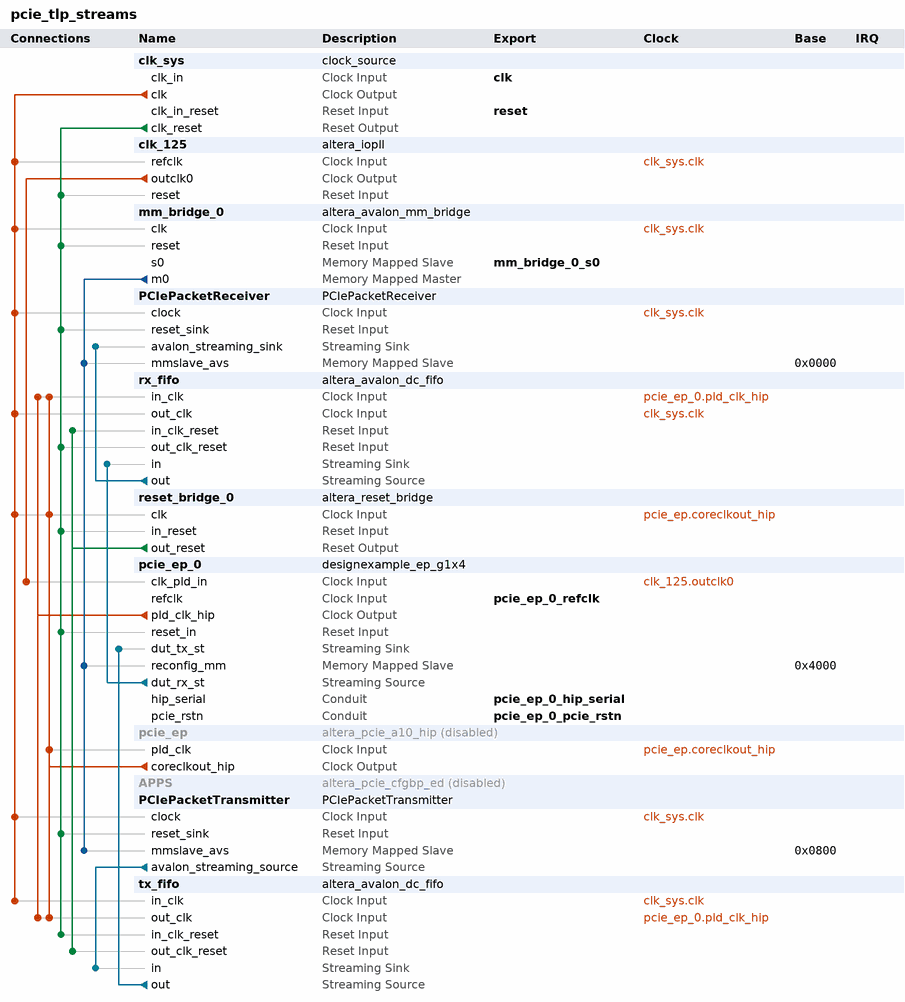
[diagram p0: system contents]
# Platform Designer (Qsys) system pcie_tlp_streams, Arria 10 10AS066N3F40E2SGE2
# Parameters at their usual value, and those the tool derives, are not listed.
package require -exact qsys 17.1
create_system pcie_tlp_streams
set_project_property DEVICE_FAMILY {Arria 10}
set_project_property DEVICE 10AS066N3F40E2SGE2

add_instance clk_sys clock_source 17.1
set_instance_parameter_value clk_sys clockFrequency 100000000

add_instance clk_125 altera_iopll 17.1
set_instance_parameter_value clk_125 gui_c_cnt_in_src0 c_m_cnt_in_src_ph_mux_clk
set_instance_parameter_value clk_125 gui_cal_code_hex_file iossm.hex
set_instance_parameter_value clk_125 gui_cal_converge false
set_instance_parameter_value clk_125 gui_cal_error cal_clean
set_instance_parameter_value clk_125 gui_clock_name_global false
set_instance_parameter_value clk_125 gui_clock_name_string0 clk125
set_instance_parameter_value clk_125 gui_clock_to_compensate 0
set_instance_parameter_value clk_125 gui_debug_mode false
set_instance_parameter_value clk_125 gui_en_lvds_ports Disabled
set_instance_parameter_value clk_125 gui_existing_mif_file_path {~/pll.mif}
set_instance_parameter_value clk_125 gui_include_iossm false
set_instance_parameter_value clk_125 gui_lock_setting {Low Lock Time}
set_instance_parameter_value clk_125 gui_mif_config_name unnamed
set_instance_parameter_value clk_125 gui_mif_gen_options {Generate New MIF File}
set_instance_parameter_value clk_125 gui_new_mif_file_path {~/pll.mif}
set_instance_parameter_value clk_125 gui_number_of_clocks 1
set_instance_parameter_value clk_125 gui_operation_mode direct
set_instance_parameter_value clk_125 gui_output_clock_frequency0 125.0
set_instance_parameter_value clk_125 gui_parameter_table_hex_file seq_params_sim.hex
set_instance_parameter_value clk_125 gui_pll_cal_done false
set_instance_parameter_value clk_125 gui_pll_freqcal_en true
set_instance_parameter_value clk_125 gui_pll_freqcal_req_flag true
set_instance_parameter_value clk_125 gui_pll_m_cnt_in_src c_m_cnt_in_src_ph_mux_clk
set_instance_parameter_value clk_125 gui_pll_tclk_mux_en false
set_instance_parameter_value clk_125 gui_pll_tclk_sel pll_tclk_m_src
set_instance_parameter_value clk_125 gui_pll_type S10_Simple
set_instance_parameter_value clk_125 gui_pll_vco_freq_band_0 pll_freq_clk0_disabled
set_instance_parameter_value clk_125 gui_reference_clock_frequency 100.0
set_instance_parameter_value clk_125 gui_use_NDFB_modes false
set_instance_parameter_value clk_125 gui_use_locked true
set_instance_parameter_value clk_125 gui_usr_device_speed_grade 1
set_instance_parameter_value clk_125 gui_vco_frequency 600.0
set_instance_parameter_value clk_125 hp_qsys_scripting_mode false
set_instance_parameter_value clk_125 system_info_device_component 10AS066N3F40E2SGE2
set_instance_parameter_value clk_125 system_info_device_speed_grade 2
set_instance_parameter_value clk_125 system_part_trait_speed_grade 2

add_instance mm_bridge_0 altera_avalon_mm_bridge 17.1
set_instance_parameter_value mm_bridge_0 ADDRESS_UNITS SYMBOLS
set_instance_parameter_value mm_bridge_0 ADDRESS_WIDTH 10
set_instance_parameter_value mm_bridge_0 DATA_WIDTH 64
set_instance_parameter_value mm_bridge_0 MAX_PENDING_RESPONSES 1
set_instance_parameter_value mm_bridge_0 USE_AUTO_ADDRESS_WIDTH 1

add_instance PCIePacketReceiver PCIePacketReceiver 1.0

add_instance rx_fifo altera_avalon_dc_fifo 17.1
set_instance_parameter_value rx_fifo BITS_PER_SYMBOL 64
set_instance_parameter_value rx_fifo FIFO_DEPTH 16
set_instance_parameter_value rx_fifo USE_PACKETS 1

add_instance reset_bridge_0 altera_reset_bridge 17.1
set_instance_parameter_value reset_bridge_0 ACTIVE_LOW_RESET 0
set_instance_parameter_value reset_bridge_0 SYNCHRONOUS_EDGES deassert

add_instance pcie_ep_0 designexample_ep_g1x4 1.0

add_instance pcie_ep altera_pcie_a10_hip 17.1
set_instance_property pcie_ep ENABLED false
set_instance_parameter_value pcie_ep adme_enable_hwtcl 0
set_instance_parameter_value pcie_ep advance_error_reporting_hwtcl 0
set_instance_parameter_value pcie_ep apps_type_hwtcl 0
set_instance_parameter_value pcie_ep ari_support_hwtcl 0
set_instance_parameter_value pcie_ep ast_trs_num_desc_hwtcl 16
set_instance_parameter_value pcie_ep ast_trs_rxdata_width_hwtcl 256
set_instance_parameter_value pcie_ep ast_trs_rxdesc_width_hwtcl 256
set_instance_parameter_value pcie_ep ast_trs_rxmty_width_hwtcl 32
set_instance_parameter_value pcie_ep ast_trs_txdata_width_hwtcl 256
set_instance_parameter_value pcie_ep ast_trs_txdesc_width_hwtcl 256
set_instance_parameter_value pcie_ep ast_trs_txmty_width_hwtcl 32
set_instance_parameter_value pcie_ep ast_trs_txstatus_width_hwtcl 256
set_instance_parameter_value pcie_ep avmm_addr_width_hwtcl 32
set_instance_parameter_value pcie_ep bar0_address_width_hwtcl 20
set_instance_parameter_value pcie_ep bar0_type_hwtcl {64-bit prefetchable memory}
set_instance_parameter_value pcie_ep bar1_address_width_hwtcl 0
set_instance_parameter_value pcie_ep bar1_type_hwtcl Disabled
set_instance_parameter_value pcie_ep bar2_address_width_hwtcl 0
set_instance_parameter_value pcie_ep bar2_type_hwtcl Disabled
set_instance_parameter_value pcie_ep bar3_address_width_hwtcl 0
set_instance_parameter_value pcie_ep bar3_type_hwtcl Disabled
set_instance_parameter_value pcie_ep base_device NIGHTFURY5
set_instance_parameter_value pcie_ep bfm_drive_interface_clk_hwtcl 1
set_instance_parameter_value pcie_ep bfm_drive_interface_control_hwtcl 1
set_instance_parameter_value pcie_ep bfm_drive_interface_npor_hwtcl 1
set_instance_parameter_value pcie_ep bfm_drive_interface_pipe_hwtcl 1
set_instance_parameter_value pcie_ep cg_a2p_addr_map_pass_thru_bits_hwtcl 20
set_instance_parameter_value pcie_ep cg_enable_a2p_interrupt_hwtcl 1
set_instance_parameter_value pcie_ep cg_enable_advanced_interrupt_hwtcl 0
set_instance_parameter_value pcie_ep class_code_hwtcl 0
set_instance_parameter_value pcie_ep completion_timeout_hwtcl NONE
set_instance_parameter_value pcie_ep cseb_autonomous_hwtcl 0
set_instance_parameter_value pcie_ep cseb_config_bypass_gui_hwtcl 0
set_instance_parameter_value pcie_ep design_environment_hwtcl QSYS
set_instance_parameter_value pcie_ep devhide_support_hwtcl 0
set_instance_parameter_value pcie_ep device_embedded_ep_support_hwtcl 0
set_instance_parameter_value pcie_ep device_id_hwtcl 57345
set_instance_parameter_value pcie_ep dis_adapt 0
set_instance_parameter_value pcie_ep dma_use_scfifo_ext_hwtcl 0
set_instance_parameter_value pcie_ep ecrc_check_capable_hwtcl 0
set_instance_parameter_value pcie_ep ecrc_gen_capable_hwtcl 0
set_instance_parameter_value pcie_ep enable_ast_trs_hwtcl 0
set_instance_parameter_value pcie_ep enable_avst_reset_hwtcl 0
set_instance_parameter_value pcie_ep enable_custom_features_hwtcl 0
set_instance_parameter_value pcie_ep enable_devkit_conduit_hwtcl 0
set_instance_parameter_value pcie_ep enable_example_design_qii_hwtcl 0
set_instance_parameter_value pcie_ep enable_example_design_sim_hwtcl 0
set_instance_parameter_value pcie_ep enable_example_design_synth_hwtcl 0
set_instance_parameter_value pcie_ep enable_example_design_tb_hwtcl 0
set_instance_parameter_value pcie_ep enable_gen3phase2eq_timechange 0
set_instance_parameter_value pcie_ep enable_hip_status_for_avmm_hwtcl 0
set_instance_parameter_value pcie_ep enable_lmi_hwtcl 1
set_instance_parameter_value pcie_ep enable_nobar_slection_hwtcl 0
set_instance_parameter_value pcie_ep enable_rxm_burst_hwtcl 0
set_instance_parameter_value pcie_ep enable_skp_det 0
set_instance_parameter_value pcie_ep enable_soft_dfe 0
set_instance_parameter_value pcie_ep export_fpll_output_to_top_level_hwtcl 0
set_instance_parameter_value pcie_ep export_phy_input_to_top_level_hwtcl 0
set_instance_parameter_value pcie_ep extended_tag_support_hwtcl 0
set_instance_parameter_value pcie_ep flr_capability_user_hwtcl 0
set_instance_parameter_value pcie_ep force_tag_checking_on_hwtcl 0
set_instance_parameter_value pcie_ep gen3_coeff_1_hwtcl 9
set_instance_parameter_value pcie_ep gen3_coeff_3_ber_meas_hwtcl 12ms
set_instance_parameter_value pcie_ep include_virtio_capabilities_hwtcl 0
set_instance_parameter_value pcie_ep interface_type_hwtcl Avalon-ST
set_instance_parameter_value pcie_ep internal_controller_hwtcl 0
set_instance_parameter_value pcie_ep link2csr_width_hwtcl 16
set_instance_parameter_value pcie_ep maximum_payload_size_hwtcl 128
set_instance_parameter_value pcie_ep part_trait_device 10AX115S1F45I1SG
set_instance_parameter_value pcie_ep pf0_ats_invalidate_queue_depth_hwtcl 0
set_instance_parameter_value pcie_ep pf0_bar0_prefetchable_hwtcl 1
set_instance_parameter_value pcie_ep pf0_bar0_present_hwtcl 1
set_instance_parameter_value pcie_ep pf0_bar0_size_hwtcl 12
set_instance_parameter_value pcie_ep pf0_bar0_type_hwtcl 1
set_instance_parameter_value pcie_ep pf0_bar1_prefetchable_hwtcl 1
set_instance_parameter_value pcie_ep pf0_bar1_present_hwtcl 0
set_instance_parameter_value pcie_ep pf0_bar1_size_hwtcl 12
set_instance_parameter_value pcie_ep pf0_bar2_prefetchable_hwtcl 1
set_instance_parameter_value pcie_ep pf0_bar2_present_hwtcl 0
set_instance_parameter_value pcie_ep pf0_bar2_size_hwtcl 12
set_instance_parameter_value pcie_ep pf0_bar2_type_hwtcl 1
set_instance_parameter_value pcie_ep pf0_bar3_prefetchable_hwtcl 1
set_instance_parameter_value pcie_ep pf0_bar3_present_hwtcl 0
set_instance_parameter_value pcie_ep pf0_bar3_size_hwtcl 12
set_instance_parameter_value pcie_ep pf0_bar4_prefetchable_hwtcl 1
set_instance_parameter_value pcie_ep pf0_bar4_present_hwtcl 0
set_instance_parameter_value pcie_ep pf0_bar4_size_hwtcl 12
set_instance_parameter_value pcie_ep pf0_bar4_type_hwtcl 1
set_instance_parameter_value pcie_ep pf0_bar5_prefetchable_hwtcl 1
set_instance_parameter_value pcie_ep pf0_bar5_present_hwtcl 0
set_instance_parameter_value pcie_ep pf0_bar5_size_hwtcl 12
set_instance_parameter_value pcie_ep pf0_exprom_bar_present_hwtcl 0
set_instance_parameter_value pcie_ep pf0_exprom_bar_size_hwtcl 12
set_instance_parameter_value pcie_ep pf0_extra_bar_present_hwtcl 0
set_instance_parameter_value pcie_ep pf0_extra_bar_size_hwtcl 12
set_instance_parameter_value pcie_ep pf0_interrupt_pin_hwtcl inta
set_instance_parameter_value pcie_ep pf0_intr_line_hwtcl 0
set_instance_parameter_value pcie_ep pf0_msi_multi_message_capable_hwtcl 4
set_instance_parameter_value pcie_ep pf0_msix_pba_bir_hwtcl 0
set_instance_parameter_value pcie_ep pf0_msix_pba_offset_hwtcl 0
set_instance_parameter_value pcie_ep pf0_msix_table_bir_hwtcl 0
set_instance_parameter_value pcie_ep pf0_msix_table_offset_hwtcl 0
set_instance_parameter_value pcie_ep pf0_msix_table_size_hwtcl 0
set_instance_parameter_value pcie_ep pf0_pci_prog_intfc_byte_hwtcl 0
set_instance_parameter_value pcie_ep pf0_subclass_code_hwtcl 0
set_instance_parameter_value pcie_ep pf0_tph_dev_specific_mode_support_hwtcl 0
set_instance_parameter_value pcie_ep pf0_tph_int_mode_support_hwtcl 0
set_instance_parameter_value pcie_ep pf0_tph_st_table_location_hwtcl 0
set_instance_parameter_value pcie_ep pf0_tph_st_table_size_hwtcl 63
set_instance_parameter_value pcie_ep pf0_vf_bar0_prefetchable_hwtcl 1
set_instance_parameter_value pcie_ep pf0_vf_bar0_present_hwtcl 0
set_instance_parameter_value pcie_ep pf0_vf_bar0_size_hwtcl 12
set_instance_parameter_value pcie_ep pf0_vf_bar0_type_hwtcl 1
set_instance_parameter_value pcie_ep pf0_vf_bar1_prefetchable_hwtcl 1
set_instance_parameter_value pcie_ep pf0_vf_bar1_present_hwtcl 0
set_instance_parameter_value pcie_ep pf0_vf_bar1_size_hwtcl 12
set_instance_parameter_value pcie_ep pf0_vf_bar2_prefetchable_hwtcl 1
set_instance_parameter_value pcie_ep pf0_vf_bar2_present_hwtcl 0
set_instance_parameter_value pcie_ep pf0_vf_bar2_size_hwtcl 12
set_instance_parameter_value pcie_ep pf0_vf_bar2_type_hwtcl 1
set_instance_parameter_value pcie_ep pf0_vf_bar3_prefetchable_hwtcl 1
set_instance_parameter_value pcie_ep pf0_vf_bar3_present_hwtcl 0
set_instance_parameter_value pcie_ep pf0_vf_bar3_size_hwtcl 12
set_instance_parameter_value pcie_ep pf0_vf_bar4_prefetchable_hwtcl 1
set_instance_parameter_value pcie_ep pf0_vf_bar4_present_hwtcl 0
set_instance_parameter_value pcie_ep pf0_vf_bar4_size_hwtcl 12
set_instance_parameter_value pcie_ep pf0_vf_bar4_type_hwtcl 1
set_instance_parameter_value pcie_ep pf0_vf_bar5_prefetchable_hwtcl 1
set_instance_parameter_value pcie_ep pf0_vf_bar5_present_hwtcl 0
set_instance_parameter_value pcie_ep pf0_vf_bar5_size_hwtcl 12
set_instance_parameter_value pcie_ep pf0_vf_count_user_hwtcl 0
set_instance_parameter_value pcie_ep pf0_vf_device_id_hwtcl 0
set_instance_parameter_value pcie_ep pf0_vf_msix_pba_bir_hwtcl 0
set_instance_parameter_value pcie_ep pf0_vf_msix_pba_offset_hwtcl 0
set_instance_parameter_value pcie_ep pf0_vf_msix_tbl_bir_hwtcl 0
set_instance_parameter_value pcie_ep pf0_vf_msix_tbl_offset_hwtcl 0
set_instance_parameter_value pcie_ep pf0_vf_msix_tbl_size_hwtcl 0
set_instance_parameter_value pcie_ep pf0_vf_tph_dev_specific_mode_support_hwtcl 0
set_instance_parameter_value pcie_ep pf0_vf_tph_int_mode_support_hwtcl 0
set_instance_parameter_value pcie_ep pf0_vf_tph_st_table_location_hwtcl 0
set_instance_parameter_value pcie_ep pf0_vf_tph_st_table_size_hwtcl 63
set_instance_parameter_value pcie_ep pf0_virtio_capability_present_hwtcl 0
set_instance_parameter_value pcie_ep pf0_virtio_cmn_config_bar_indicator_hwtcl 0
set_instance_parameter_value pcie_ep pf0_virtio_cmn_config_bar_offset_hwtcl 0
set_instance_parameter_value pcie_ep pf0_virtio_cmn_config_structure_length_hwtcl 0
set_instance_parameter_value pcie_ep pf0_virtio_device_specific_cap_present_hwtcl 0
set_instance_parameter_value pcie_ep pf0_virtio_devspecific_bar_indicator_hwtcl 0
set_instance_parameter_value pcie_ep pf0_virtio_devspecific_bar_offset_hwtcl 0
set_instance_parameter_value pcie_ep pf0_virtio_devspecific_structure_length_hwtcl 0
set_instance_parameter_value pcie_ep pf0_virtio_isrstatus_bar_indicator_hwtcl 0
set_instance_parameter_value pcie_ep pf0_virtio_isrstatus_bar_offset_hwtcl 0
set_instance_parameter_value pcie_ep pf0_virtio_isrstatus_structure_length_hwtcl 0
set_instance_parameter_value pcie_ep pf0_virtio_notification_bar_indicator_hwtcl 0
set_instance_parameter_value pcie_ep pf0_virtio_notification_bar_offset_hwtcl 0
set_instance_parameter_value pcie_ep pf0_virtio_notification_structure_length_hwtcl 0
set_instance_parameter_value pcie_ep pf0_virtio_pciconfig_access_bar_indicator_hwtcl 0
set_instance_parameter_value pcie_ep pf0_virtio_pciconfig_access_bar_offset_hwtcl 0
set_instance_parameter_value pcie_ep pf0_virtio_pciconfig_access_structure_length_hwtcl 0
set_instance_parameter_value pcie_ep pf1_ats_invalidate_queue_depth_hwtcl 0
set_instance_parameter_value pcie_ep pf1_bar0_prefetchable_hwtcl 1
set_instance_parameter_value pcie_ep pf1_bar0_present_hwtcl 0
set_instance_parameter_value pcie_ep pf1_bar0_size_hwtcl 12
set_instance_parameter_value pcie_ep pf1_bar0_type_hwtcl 1
set_instance_parameter_value pcie_ep pf1_bar1_prefetchable_hwtcl 1
set_instance_parameter_value pcie_ep pf1_bar1_present_hwtcl 0
set_instance_parameter_value pcie_ep pf1_bar1_size_hwtcl 12
set_instance_parameter_value pcie_ep pf1_bar2_prefetchable_hwtcl 1
set_instance_parameter_value pcie_ep pf1_bar2_present_hwtcl 0
set_instance_parameter_value pcie_ep pf1_bar2_size_hwtcl 12
set_instance_parameter_value pcie_ep pf1_bar2_type_hwtcl 1
set_instance_parameter_value pcie_ep pf1_bar3_prefetchable_hwtcl 1
set_instance_parameter_value pcie_ep pf1_bar3_present_hwtcl 0
set_instance_parameter_value pcie_ep pf1_bar3_size_hwtcl 12
set_instance_parameter_value pcie_ep pf1_bar4_prefetchable_hwtcl 1
set_instance_parameter_value pcie_ep pf1_bar4_present_hwtcl 0
set_instance_parameter_value pcie_ep pf1_bar4_size_hwtcl 12
set_instance_parameter_value pcie_ep pf1_bar4_type_hwtcl 1
set_instance_parameter_value pcie_ep pf1_bar5_prefetchable_hwtcl 1
set_instance_parameter_value pcie_ep pf1_bar5_present_hwtcl 0
set_instance_parameter_value pcie_ep pf1_bar5_size_hwtcl 12
set_instance_parameter_value pcie_ep pf1_class_code_hwtcl 0
set_instance_parameter_value pcie_ep pf1_device_id_hwtcl 0
set_instance_parameter_value pcie_ep pf1_exprom_bar_present_hwtcl 0
set_instance_parameter_value pcie_ep pf1_exprom_bar_size_hwtcl 12
set_instance_parameter_value pcie_ep pf1_interrupt_pin_hwtcl inta
set_instance_parameter_value pcie_ep pf1_intr_line_hwtcl 0
set_instance_parameter_value pcie_ep pf1_msi_multi_message_capable_hwtcl 4
set_instance_parameter_value pcie_ep pf1_msix_pba_bir_hwtcl 0
set_instance_parameter_value pcie_ep pf1_msix_pba_offset_hwtcl 0
set_instance_parameter_value pcie_ep pf1_msix_table_bir_hwtcl 0
set_instance_parameter_value pcie_ep pf1_msix_table_offset_hwtcl 0
set_instance_parameter_value pcie_ep pf1_msix_table_size_hwtcl 0
set_instance_parameter_value pcie_ep pf1_pci_prog_intfc_byte_hwtcl 0
set_instance_parameter_value pcie_ep pf1_revision_id_hwtcl 0
set_instance_parameter_value pcie_ep pf1_subclass_code_hwtcl 0
set_instance_parameter_value pcie_ep pf1_subsystem_device_id_hwtcl 0
set_instance_parameter_value pcie_ep pf1_subsystem_vendor_id_hwtcl 0
set_instance_parameter_value pcie_ep pf1_tph_dev_specific_mode_support_hwtcl 0
set_instance_parameter_value pcie_ep pf1_tph_int_mode_support_hwtcl 0
set_instance_parameter_value pcie_ep pf1_tph_st_table_location_hwtcl 0
set_instance_parameter_value pcie_ep pf1_tph_st_table_size_hwtcl 63
set_instance_parameter_value pcie_ep pf1_vendor_id_hwtcl 0
set_instance_parameter_value pcie_ep pf1_vf_bar0_prefetchable_hwtcl 1
set_instance_parameter_value pcie_ep pf1_vf_bar0_present_hwtcl 0
set_instance_parameter_value pcie_ep pf1_vf_bar0_size_hwtcl 12
set_instance_parameter_value pcie_ep pf1_vf_bar0_type_hwtcl 1
set_instance_parameter_value pcie_ep pf1_vf_bar1_prefetchable_hwtcl 1
set_instance_parameter_value pcie_ep pf1_vf_bar1_present_hwtcl 0
set_instance_parameter_value pcie_ep pf1_vf_bar1_size_hwtcl 12
set_instance_parameter_value pcie_ep pf1_vf_bar2_prefetchable_hwtcl 1
set_instance_parameter_value pcie_ep pf1_vf_bar2_present_hwtcl 0
set_instance_parameter_value pcie_ep pf1_vf_bar2_size_hwtcl 12
set_instance_parameter_value pcie_ep pf1_vf_bar2_type_hwtcl 1
set_instance_parameter_value pcie_ep pf1_vf_bar3_prefetchable_hwtcl 1
set_instance_parameter_value pcie_ep pf1_vf_bar3_present_hwtcl 0
set_instance_parameter_value pcie_ep pf1_vf_bar3_size_hwtcl 12
set_instance_parameter_value pcie_ep pf1_vf_bar4_prefetchable_hwtcl 1
set_instance_parameter_value pcie_ep pf1_vf_bar4_present_hwtcl 0
set_instance_parameter_value pcie_ep pf1_vf_bar4_size_hwtcl 12
set_instance_parameter_value pcie_ep pf1_vf_bar4_type_hwtcl 1
set_instance_parameter_value pcie_ep pf1_vf_bar5_prefetchable_hwtcl 1
set_instance_parameter_value pcie_ep pf1_vf_bar5_present_hwtcl 0
set_instance_parameter_value pcie_ep pf1_vf_bar5_size_hwtcl 12
set_instance_parameter_value pcie_ep pf1_vf_count_user_hwtcl 0
set_instance_parameter_value pcie_ep pf1_vf_device_id_hwtcl 0
set_instance_parameter_value pcie_ep pf1_vf_msix_pba_bir_hwtcl 0
set_instance_parameter_value pcie_ep pf1_vf_msix_pba_offset_hwtcl 0
set_instance_parameter_value pcie_ep pf1_vf_msix_tbl_bir_hwtcl 0
set_instance_parameter_value pcie_ep pf1_vf_msix_tbl_offset_hwtcl 0
set_instance_parameter_value pcie_ep pf1_vf_msix_tbl_size_hwtcl 0
set_instance_parameter_value pcie_ep pf1_vf_tph_dev_specific_mode_support_hwtcl 0
set_instance_parameter_value pcie_ep pf1_vf_tph_int_mode_support_hwtcl 0
set_instance_parameter_value pcie_ep pf1_vf_tph_st_table_location_hwtcl 0
set_instance_parameter_value pcie_ep pf1_vf_tph_st_table_size_hwtcl 63
set_instance_parameter_value pcie_ep pf1_virtio_capability_present_hwtcl 0
set_instance_parameter_value pcie_ep pf1_virtio_cmn_config_bar_indicator_hwtcl 0
set_instance_parameter_value pcie_ep pf1_virtio_cmn_config_bar_offset_hwtcl 0
set_instance_parameter_value pcie_ep pf1_virtio_cmn_config_structure_length_hwtcl 0
set_instance_parameter_value pcie_ep pf1_virtio_device_specific_cap_present_hwtcl 0
set_instance_parameter_value pcie_ep pf1_virtio_devspecific_bar_indicator_hwtcl 0
set_instance_parameter_value pcie_ep pf1_virtio_devspecific_bar_offset_hwtcl 0
set_instance_parameter_value pcie_ep pf1_virtio_devspecific_structure_length_hwtcl 0
set_instance_parameter_value pcie_ep pf1_virtio_isrstatus_bar_indicator_hwtcl 0
set_instance_parameter_value pcie_ep pf1_virtio_isrstatus_bar_offset_hwtcl 0
set_instance_parameter_value pcie_ep pf1_virtio_isrstatus_structure_length_hwtcl 0
set_instance_parameter_value pcie_ep pf1_virtio_notification_bar_indicator_hwtcl 0
set_instance_parameter_value pcie_ep pf1_virtio_notification_bar_offset_hwtcl 0
set_instance_parameter_value pcie_ep pf1_virtio_notification_structure_length_hwtcl 0
set_instance_parameter_value pcie_ep pf1_virtio_pciconfig_access_bar_indicator_hwtcl 0
set_instance_parameter_value pcie_ep pf1_virtio_pciconfig_access_bar_offset_hwtcl 0
set_instance_parameter_value pcie_ep pf1_virtio_pciconfig_access_structure_length_hwtcl 0
set_instance_parameter_value pcie_ep pf2_ats_invalidate_queue_depth_hwtcl 0
set_instance_parameter_value pcie_ep pf2_bar0_prefetchable_hwtcl 1
set_instance_parameter_value pcie_ep pf2_bar0_present_hwtcl 0
set_instance_parameter_value pcie_ep pf2_bar0_size_hwtcl 12
set_instance_parameter_value pcie_ep pf2_bar0_type_hwtcl 1
set_instance_parameter_value pcie_ep pf2_bar1_prefetchable_hwtcl 1
set_instance_parameter_value pcie_ep pf2_bar1_present_hwtcl 0
set_instance_parameter_value pcie_ep pf2_bar1_size_hwtcl 12
set_instance_parameter_value pcie_ep pf2_bar2_prefetchable_hwtcl 1
set_instance_parameter_value pcie_ep pf2_bar2_present_hwtcl 0
set_instance_parameter_value pcie_ep pf2_bar2_size_hwtcl 12
set_instance_parameter_value pcie_ep pf2_bar2_type_hwtcl 1
set_instance_parameter_value pcie_ep pf2_bar3_prefetchable_hwtcl 1
set_instance_parameter_value pcie_ep pf2_bar3_present_hwtcl 0
set_instance_parameter_value pcie_ep pf2_bar3_size_hwtcl 12
set_instance_parameter_value pcie_ep pf2_bar4_prefetchable_hwtcl 1
set_instance_parameter_value pcie_ep pf2_bar4_present_hwtcl 0
set_instance_parameter_value pcie_ep pf2_bar4_size_hwtcl 12
set_instance_parameter_value pcie_ep pf2_bar4_type_hwtcl 1
set_instance_parameter_value pcie_ep pf2_bar5_prefetchable_hwtcl 1
set_instance_parameter_value pcie_ep pf2_bar5_present_hwtcl 0
set_instance_parameter_value pcie_ep pf2_bar5_size_hwtcl 12
set_instance_parameter_value pcie_ep pf2_class_code_hwtcl 0
set_instance_parameter_value pcie_ep pf2_device_id_hwtcl 0
set_instance_parameter_value pcie_ep pf2_exprom_bar_present_hwtcl 0
set_instance_parameter_value pcie_ep pf2_exprom_bar_size_hwtcl 12
set_instance_parameter_value pcie_ep pf2_interrupt_pin_hwtcl inta
set_instance_parameter_value pcie_ep pf2_intr_line_hwtcl 0
set_instance_parameter_value pcie_ep pf2_msi_multi_message_capable_hwtcl 4
set_instance_parameter_value pcie_ep pf2_msix_pba_bir_hwtcl 0
set_instance_parameter_value pcie_ep pf2_msix_pba_offset_hwtcl 0
set_instance_parameter_value pcie_ep pf2_msix_table_bir_hwtcl 0
set_instance_parameter_value pcie_ep pf2_msix_table_offset_hwtcl 0
set_instance_parameter_value pcie_ep pf2_msix_table_size_hwtcl 0
set_instance_parameter_value pcie_ep pf2_pci_prog_intfc_byte_hwtcl 0
set_instance_parameter_value pcie_ep pf2_revision_id_hwtcl 0
set_instance_parameter_value pcie_ep pf2_subclass_code_hwtcl 0
set_instance_parameter_value pcie_ep pf2_subsystem_device_id_hwtcl 0
set_instance_parameter_value pcie_ep pf2_subsystem_vendor_id_hwtcl 0
set_instance_parameter_value pcie_ep pf2_tph_dev_specific_mode_support_hwtcl 0
set_instance_parameter_value pcie_ep pf2_tph_int_mode_support_hwtcl 0
set_instance_parameter_value pcie_ep pf2_tph_st_table_location_hwtcl 0
set_instance_parameter_value pcie_ep pf2_tph_st_table_size_hwtcl 63
set_instance_parameter_value pcie_ep pf2_vendor_id_hwtcl 0
set_instance_parameter_value pcie_ep pf2_vf_bar0_prefetchable_hwtcl 1
set_instance_parameter_value pcie_ep pf2_vf_bar0_present_hwtcl 0
set_instance_parameter_value pcie_ep pf2_vf_bar0_size_hwtcl 12
set_instance_parameter_value pcie_ep pf2_vf_bar0_type_hwtcl 1
set_instance_parameter_value pcie_ep pf2_vf_bar1_prefetchable_hwtcl 1
set_instance_parameter_value pcie_ep pf2_vf_bar1_present_hwtcl 0
set_instance_parameter_value pcie_ep pf2_vf_bar1_size_hwtcl 12
set_instance_parameter_value pcie_ep pf2_vf_bar2_prefetchable_hwtcl 1
set_instance_parameter_value pcie_ep pf2_vf_bar2_present_hwtcl 0
set_instance_parameter_value pcie_ep pf2_vf_bar2_size_hwtcl 12
set_instance_parameter_value pcie_ep pf2_vf_bar2_type_hwtcl 1
set_instance_parameter_value pcie_ep pf2_vf_bar3_prefetchable_hwtcl 1
set_instance_parameter_value pcie_ep pf2_vf_bar3_present_hwtcl 0
set_instance_parameter_value pcie_ep pf2_vf_bar3_size_hwtcl 12
set_instance_parameter_value pcie_ep pf2_vf_bar4_prefetchable_hwtcl 1
set_instance_parameter_value pcie_ep pf2_vf_bar4_present_hwtcl 0
set_instance_parameter_value pcie_ep pf2_vf_bar4_size_hwtcl 12
set_instance_parameter_value pcie_ep pf2_vf_bar4_type_hwtcl 1
set_instance_parameter_value pcie_ep pf2_vf_bar5_prefetchable_hwtcl 1
set_instance_parameter_value pcie_ep pf2_vf_bar5_present_hwtcl 0
set_instance_parameter_value pcie_ep pf2_vf_bar5_size_hwtcl 12
set_instance_parameter_value pcie_ep pf2_vf_count_user_hwtcl 0
set_instance_parameter_value pcie_ep pf2_vf_device_id_hwtcl 0
set_instance_parameter_value pcie_ep pf2_vf_msix_pba_bir_hwtcl 0
set_instance_parameter_value pcie_ep pf2_vf_msix_pba_offset_hwtcl 0
set_instance_parameter_value pcie_ep pf2_vf_msix_tbl_bir_hwtcl 0
set_instance_parameter_value pcie_ep pf2_vf_msix_tbl_offset_hwtcl 0
set_instance_parameter_value pcie_ep pf2_vf_msix_tbl_size_hwtcl 0
set_instance_parameter_value pcie_ep pf2_vf_tph_dev_specific_mode_support_hwtcl 0
set_instance_parameter_value pcie_ep pf2_vf_tph_int_mode_support_hwtcl 0
set_instance_parameter_value pcie_ep pf2_vf_tph_st_table_location_hwtcl 0
set_instance_parameter_value pcie_ep pf2_vf_tph_st_table_size_hwtcl 63
set_instance_parameter_value pcie_ep pf2_virtio_capability_present_hwtcl 0
set_instance_parameter_value pcie_ep pf2_virtio_cmn_config_bar_indicator_hwtcl 0
set_instance_parameter_value pcie_ep pf2_virtio_cmn_config_bar_offset_hwtcl 0
set_instance_parameter_value pcie_ep pf2_virtio_cmn_config_structure_length_hwtcl 0
set_instance_parameter_value pcie_ep pf2_virtio_device_specific_cap_present_hwtcl 0
set_instance_parameter_value pcie_ep pf2_virtio_devspecific_bar_indicator_hwtcl 0
set_instance_parameter_value pcie_ep pf2_virtio_devspecific_bar_offset_hwtcl 0
set_instance_parameter_value pcie_ep pf2_virtio_devspecific_structure_length_hwtcl 0
set_instance_parameter_value pcie_ep pf2_virtio_isrstatus_bar_indicator_hwtcl 0
set_instance_parameter_value pcie_ep pf2_virtio_isrstatus_bar_offset_hwtcl 0
set_instance_parameter_value pcie_ep pf2_virtio_isrstatus_structure_length_hwtcl 0
set_instance_parameter_value pcie_ep pf2_virtio_notification_bar_indicator_hwtcl 0
set_instance_parameter_value pcie_ep pf2_virtio_notification_bar_offset_hwtcl 0
set_instance_parameter_value pcie_ep pf2_virtio_notification_structure_length_hwtcl 0
set_instance_parameter_value pcie_ep pf2_virtio_pciconfig_access_bar_indicator_hwtcl 0
set_instance_parameter_value pcie_ep pf2_virtio_pciconfig_access_bar_offset_hwtcl 0
set_instance_parameter_value pcie_ep pf2_virtio_pciconfig_access_structure_length_hwtcl 0
set_instance_parameter_value pcie_ep pf3_ats_invalidate_queue_depth_hwtcl 0
set_instance_parameter_value pcie_ep pf3_bar0_prefetchable_hwtcl 1
set_instance_parameter_value pcie_ep pf3_bar0_present_hwtcl 0
set_instance_parameter_value pcie_ep pf3_bar0_size_hwtcl 12
set_instance_parameter_value pcie_ep pf3_bar0_type_hwtcl 1
set_instance_parameter_value pcie_ep pf3_bar1_prefetchable_hwtcl 1
set_instance_parameter_value pcie_ep pf3_bar1_present_hwtcl 0
set_instance_parameter_value pcie_ep pf3_bar1_size_hwtcl 12
set_instance_parameter_value pcie_ep pf3_bar2_prefetchable_hwtcl 1
set_instance_parameter_value pcie_ep pf3_bar2_present_hwtcl 0
set_instance_parameter_value pcie_ep pf3_bar2_size_hwtcl 12
set_instance_parameter_value pcie_ep pf3_bar2_type_hwtcl 1
set_instance_parameter_value pcie_ep pf3_bar3_prefetchable_hwtcl 1
set_instance_parameter_value pcie_ep pf3_bar3_present_hwtcl 0
set_instance_parameter_value pcie_ep pf3_bar3_size_hwtcl 12
set_instance_parameter_value pcie_ep pf3_bar4_prefetchable_hwtcl 1
set_instance_parameter_value pcie_ep pf3_bar4_present_hwtcl 0
set_instance_parameter_value pcie_ep pf3_bar4_size_hwtcl 12
set_instance_parameter_value pcie_ep pf3_bar4_type_hwtcl 1
set_instance_parameter_value pcie_ep pf3_bar5_prefetchable_hwtcl 1
set_instance_parameter_value pcie_ep pf3_bar5_present_hwtcl 0
set_instance_parameter_value pcie_ep pf3_bar5_size_hwtcl 12
set_instance_parameter_value pcie_ep pf3_class_code_hwtcl 0
set_instance_parameter_value pcie_ep pf3_device_id_hwtcl 0
set_instance_parameter_value pcie_ep pf3_exprom_bar_present_hwtcl 0
set_instance_parameter_value pcie_ep pf3_exprom_bar_size_hwtcl 12
set_instance_parameter_value pcie_ep pf3_interrupt_pin_hwtcl inta
set_instance_parameter_value pcie_ep pf3_intr_line_hwtcl 0
set_instance_parameter_value pcie_ep pf3_msi_multi_message_capable_hwtcl 4
set_instance_parameter_value pcie_ep pf3_msix_pba_bir_hwtcl 0
set_instance_parameter_value pcie_ep pf3_msix_pba_offset_hwtcl 0
set_instance_parameter_value pcie_ep pf3_msix_table_bir_hwtcl 0
set_instance_parameter_value pcie_ep pf3_msix_table_offset_hwtcl 0
set_instance_parameter_value pcie_ep pf3_msix_table_size_hwtcl 0
set_instance_parameter_value pcie_ep pf3_pci_prog_intfc_byte_hwtcl 0
set_instance_parameter_value pcie_ep pf3_revision_id_hwtcl 0
set_instance_parameter_value pcie_ep pf3_subclass_code_hwtcl 0
set_instance_parameter_value pcie_ep pf3_subsystem_device_id_hwtcl 0
set_instance_parameter_value pcie_ep pf3_subsystem_vendor_id_hwtcl 0
set_instance_parameter_value pcie_ep pf3_tph_dev_specific_mode_support_hwtcl 0
set_instance_parameter_value pcie_ep pf3_tph_int_mode_support_hwtcl 0
set_instance_parameter_value pcie_ep pf3_tph_st_table_location_hwtcl 0
set_instance_parameter_value pcie_ep pf3_tph_st_table_size_hwtcl 63
set_instance_parameter_value pcie_ep pf3_vendor_id_hwtcl 0
set_instance_parameter_value pcie_ep pf3_vf_bar0_prefetchable_hwtcl 1
set_instance_parameter_value pcie_ep pf3_vf_bar0_present_hwtcl 0
set_instance_parameter_value pcie_ep pf3_vf_bar0_size_hwtcl 12
set_instance_parameter_value pcie_ep pf3_vf_bar0_type_hwtcl 1
set_instance_parameter_value pcie_ep pf3_vf_bar1_prefetchable_hwtcl 1
set_instance_parameter_value pcie_ep pf3_vf_bar1_present_hwtcl 0
set_instance_parameter_value pcie_ep pf3_vf_bar1_size_hwtcl 12
set_instance_parameter_value pcie_ep pf3_vf_bar2_prefetchable_hwtcl 1
set_instance_parameter_value pcie_ep pf3_vf_bar2_present_hwtcl 0
set_instance_parameter_value pcie_ep pf3_vf_bar2_size_hwtcl 12
set_instance_parameter_value pcie_ep pf3_vf_bar2_type_hwtcl 1
set_instance_parameter_value pcie_ep pf3_vf_bar3_prefetchable_hwtcl 1
set_instance_parameter_value pcie_ep pf3_vf_bar3_present_hwtcl 0
set_instance_parameter_value pcie_ep pf3_vf_bar3_size_hwtcl 12
set_instance_parameter_value pcie_ep pf3_vf_bar4_prefetchable_hwtcl 1
set_instance_parameter_value pcie_ep pf3_vf_bar4_present_hwtcl 0
set_instance_parameter_value pcie_ep pf3_vf_bar4_size_hwtcl 12
set_instance_parameter_value pcie_ep pf3_vf_bar4_type_hwtcl 1
set_instance_parameter_value pcie_ep pf3_vf_bar5_prefetchable_hwtcl 1
set_instance_parameter_value pcie_ep pf3_vf_bar5_present_hwtcl 0
set_instance_parameter_value pcie_ep pf3_vf_bar5_size_hwtcl 12
set_instance_parameter_value pcie_ep pf3_vf_count_user_hwtcl 0
set_instance_parameter_value pcie_ep pf3_vf_device_id_hwtcl 0
set_instance_parameter_value pcie_ep pf3_vf_msix_pba_bir_hwtcl 0
set_instance_parameter_value pcie_ep pf3_vf_msix_pba_offset_hwtcl 0
set_instance_parameter_value pcie_ep pf3_vf_msix_tbl_bir_hwtcl 0
set_instance_parameter_value pcie_ep pf3_vf_msix_tbl_offset_hwtcl 0
set_instance_parameter_value pcie_ep pf3_vf_msix_tbl_size_hwtcl 0
set_instance_parameter_value pcie_ep pf3_vf_tph_dev_specific_mode_support_hwtcl 0
set_instance_parameter_value pcie_ep pf3_vf_tph_int_mode_support_hwtcl 0
set_instance_parameter_value pcie_ep pf3_vf_tph_st_table_location_hwtcl 0
set_instance_parameter_value pcie_ep pf3_vf_tph_st_table_size_hwtcl 63
set_instance_parameter_value pcie_ep pf3_virtio_capability_present_hwtcl 0
set_instance_parameter_value pcie_ep pf3_virtio_cmn_config_bar_indicator_hwtcl 0
set_instance_parameter_value pcie_ep pf3_virtio_cmn_config_bar_offset_hwtcl 0
set_instance_parameter_value pcie_ep pf3_virtio_cmn_config_structure_length_hwtcl 0
set_instance_parameter_value pcie_ep pf3_virtio_device_specific_cap_present_hwtcl 0
set_instance_parameter_value pcie_ep pf3_virtio_devspecific_bar_indicator_hwtcl 0
set_instance_parameter_value pcie_ep pf3_virtio_devspecific_bar_offset_hwtcl 0
set_instance_parameter_value pcie_ep pf3_virtio_devspecific_structure_length_hwtcl 0
set_instance_parameter_value pcie_ep pf3_virtio_isrstatus_bar_indicator_hwtcl 0
set_instance_parameter_value pcie_ep pf3_virtio_isrstatus_bar_offset_hwtcl 0
set_instance_parameter_value pcie_ep pf3_virtio_isrstatus_structure_length_hwtcl 0
set_instance_parameter_value pcie_ep pf3_virtio_notification_bar_indicator_hwtcl 0
set_instance_parameter_value pcie_ep pf3_virtio_notification_bar_offset_hwtcl 0
set_instance_parameter_value pcie_ep pf3_virtio_notification_structure_length_hwtcl 0
set_instance_parameter_value pcie_ep pf3_virtio_pciconfig_access_bar_indicator_hwtcl 0
set_instance_parameter_value pcie_ep pf3_virtio_pciconfig_access_bar_offset_hwtcl 0
set_instance_parameter_value pcie_ep pf3_virtio_pciconfig_access_structure_length_hwtcl 0
set_instance_parameter_value pcie_ep pf4_bar0_prefetchable_hwtcl 1
set_instance_parameter_value pcie_ep pf4_bar0_present_hwtcl 0
set_instance_parameter_value pcie_ep pf4_bar0_size_hwtcl 12
set_instance_parameter_value pcie_ep pf4_bar0_type_hwtcl 1
set_instance_parameter_value pcie_ep pf4_bar1_prefetchable_hwtcl 1
set_instance_parameter_value pcie_ep pf4_bar1_present_hwtcl 0
set_instance_parameter_value pcie_ep pf4_bar1_size_hwtcl 12
set_instance_parameter_value pcie_ep pf4_bar2_prefetchable_hwtcl 1
set_instance_parameter_value pcie_ep pf4_bar2_present_hwtcl 0
set_instance_parameter_value pcie_ep pf4_bar2_size_hwtcl 12
set_instance_parameter_value pcie_ep pf4_bar2_type_hwtcl 1
set_instance_parameter_value pcie_ep pf4_bar3_prefetchable_hwtcl 1
set_instance_parameter_value pcie_ep pf4_bar3_present_hwtcl 0
set_instance_parameter_value pcie_ep pf4_bar3_size_hwtcl 12
set_instance_parameter_value pcie_ep pf4_bar4_prefetchable_hwtcl 1
set_instance_parameter_value pcie_ep pf4_bar4_present_hwtcl 0
set_instance_parameter_value pcie_ep pf4_bar4_size_hwtcl 12
set_instance_parameter_value pcie_ep pf4_bar4_type_hwtcl 1
set_instance_parameter_value pcie_ep pf4_bar5_prefetchable_hwtcl 1
set_instance_parameter_value pcie_ep pf4_bar5_present_hwtcl 0
set_instance_parameter_value pcie_ep pf4_bar5_size_hwtcl 12
set_instance_parameter_value pcie_ep pf4_class_code_hwtcl 0
set_instance_parameter_value pcie_ep pf4_device_id_hwtcl 0
set_instance_parameter_value pcie_ep pf4_exprom_bar_present_hwtcl 0
set_instance_parameter_value pcie_ep pf4_exprom_bar_size_hwtcl 12
set_instance_parameter_value pcie_ep pf4_interrupt_pin_hwtcl inta
set_instance_parameter_value pcie_ep pf4_intr_line_hwtcl 0
set_instance_parameter_value pcie_ep pf4_msi_multi_message_capable_hwtcl 4
set_instance_parameter_value pcie_ep pf4_msix_pba_bir_hwtcl 0
set_instance_parameter_value pcie_ep pf4_msix_pba_offset_hwtcl 0
set_instance_parameter_value pcie_ep pf4_msix_table_bir_hwtcl 0
set_instance_parameter_value pcie_ep pf4_msix_table_offset_hwtcl 0
set_instance_parameter_value pcie_ep pf4_msix_table_size_hwtcl 0
set_instance_parameter_value pcie_ep pf4_pci_prog_intfc_byte_hwtcl 0
set_instance_parameter_value pcie_ep pf4_revision_id_hwtcl 0
set_instance_parameter_value pcie_ep pf4_subclass_code_hwtcl 0
set_instance_parameter_value pcie_ep pf4_subsystem_device_id_hwtcl 0
set_instance_parameter_value pcie_ep pf4_subsystem_vendor_id_hwtcl 0
set_instance_parameter_value pcie_ep pf4_vendor_id_hwtcl 0
set_instance_parameter_value pcie_ep pf4_vf_device_id_hwtcl 0
set_instance_parameter_value pcie_ep pf4_virtio_capability_present_hwtcl 0
set_instance_parameter_value pcie_ep pf4_virtio_cmn_config_bar_indicator_hwtcl 0
set_instance_parameter_value pcie_ep pf4_virtio_cmn_config_bar_offset_hwtcl 0
set_instance_parameter_value pcie_ep pf4_virtio_cmn_config_structure_length_hwtcl 0
set_instance_parameter_value pcie_ep pf4_virtio_device_specific_cap_present_hwtcl 0
set_instance_parameter_value pcie_ep pf4_virtio_devspecific_bar_indicator_hwtcl 0
set_instance_parameter_value pcie_ep pf4_virtio_devspecific_bar_offset_hwtcl 0
set_instance_parameter_value pcie_ep pf4_virtio_devspecific_structure_length_hwtcl 0
set_instance_parameter_value pcie_ep pf4_virtio_isrstatus_bar_indicator_hwtcl 0
set_instance_parameter_value pcie_ep pf4_virtio_isrstatus_bar_offset_hwtcl 0
set_instance_parameter_value pcie_ep pf4_virtio_isrstatus_structure_length_hwtcl 0
set_instance_parameter_value pcie_ep pf4_virtio_notification_bar_indicator_hwtcl 0
set_instance_parameter_value pcie_ep pf4_virtio_notification_bar_offset_hwtcl 0
set_instance_parameter_value pcie_ep pf4_virtio_notification_structure_length_hwtcl 0
set_instance_parameter_value pcie_ep pf4_virtio_pciconfig_access_bar_indicator_hwtcl 0
set_instance_parameter_value pcie_ep pf4_virtio_pciconfig_access_bar_offset_hwtcl 0
set_instance_parameter_value pcie_ep pf4_virtio_pciconfig_access_structure_length_hwtcl 0
set_instance_parameter_value pcie_ep pf5_bar0_prefetchable_hwtcl 1
set_instance_parameter_value pcie_ep pf5_bar0_present_hwtcl 0
set_instance_parameter_value pcie_ep pf5_bar0_size_hwtcl 12
set_instance_parameter_value pcie_ep pf5_bar0_type_hwtcl 1
set_instance_parameter_value pcie_ep pf5_bar1_prefetchable_hwtcl 1
set_instance_parameter_value pcie_ep pf5_bar1_present_hwtcl 0
set_instance_parameter_value pcie_ep pf5_bar1_size_hwtcl 12
set_instance_parameter_value pcie_ep pf5_bar2_prefetchable_hwtcl 1
set_instance_parameter_value pcie_ep pf5_bar2_present_hwtcl 0
set_instance_parameter_value pcie_ep pf5_bar2_size_hwtcl 12
set_instance_parameter_value pcie_ep pf5_bar2_type_hwtcl 1
set_instance_parameter_value pcie_ep pf5_bar3_prefetchable_hwtcl 1
set_instance_parameter_value pcie_ep pf5_bar3_present_hwtcl 0
set_instance_parameter_value pcie_ep pf5_bar3_size_hwtcl 12
set_instance_parameter_value pcie_ep pf5_bar4_prefetchable_hwtcl 1
set_instance_parameter_value pcie_ep pf5_bar4_present_hwtcl 0
set_instance_parameter_value pcie_ep pf5_bar4_size_hwtcl 12
set_instance_parameter_value pcie_ep pf5_bar4_type_hwtcl 1
set_instance_parameter_value pcie_ep pf5_bar5_prefetchable_hwtcl 1
set_instance_parameter_value pcie_ep pf5_bar5_present_hwtcl 0
set_instance_parameter_value pcie_ep pf5_bar5_size_hwtcl 12
set_instance_parameter_value pcie_ep pf5_class_code_hwtcl 0
set_instance_parameter_value pcie_ep pf5_device_id_hwtcl 0
set_instance_parameter_value pcie_ep pf5_exprom_bar_present_hwtcl 0
set_instance_parameter_value pcie_ep pf5_exprom_bar_size_hwtcl 12
set_instance_parameter_value pcie_ep pf5_interrupt_pin_hwtcl inta
set_instance_parameter_value pcie_ep pf5_intr_line_hwtcl 0
set_instance_parameter_value pcie_ep pf5_msi_multi_message_capable_hwtcl 4
set_instance_parameter_value pcie_ep pf5_msix_pba_bir_hwtcl 0
set_instance_parameter_value pcie_ep pf5_msix_pba_offset_hwtcl 0
set_instance_parameter_value pcie_ep pf5_msix_table_bir_hwtcl 0
set_instance_parameter_value pcie_ep pf5_msix_table_offset_hwtcl 0
set_instance_parameter_value pcie_ep pf5_msix_table_size_hwtcl 0
set_instance_parameter_value pcie_ep pf5_pci_prog_intfc_byte_hwtcl 0
set_instance_parameter_value pcie_ep pf5_revision_id_hwtcl 0
set_instance_parameter_value pcie_ep pf5_subclass_code_hwtcl 0
set_instance_parameter_value pcie_ep pf5_subsystem_device_id_hwtcl 0
set_instance_parameter_value pcie_ep pf5_subsystem_vendor_id_hwtcl 0
set_instance_parameter_value pcie_ep pf5_vendor_id_hwtcl 0
set_instance_parameter_value pcie_ep pf5_vf_device_id_hwtcl 0
set_instance_parameter_value pcie_ep pf5_virtio_capability_present_hwtcl 0
set_instance_parameter_value pcie_ep pf5_virtio_cmn_config_bar_indicator_hwtcl 0
set_instance_parameter_value pcie_ep pf5_virtio_cmn_config_bar_offset_hwtcl 0
set_instance_parameter_value pcie_ep pf5_virtio_cmn_config_structure_length_hwtcl 0
set_instance_parameter_value pcie_ep pf5_virtio_device_specific_cap_present_hwtcl 0
set_instance_parameter_value pcie_ep pf5_virtio_devspecific_bar_indicator_hwtcl 0
set_instance_parameter_value pcie_ep pf5_virtio_devspecific_bar_offset_hwtcl 0
set_instance_parameter_value pcie_ep pf5_virtio_devspecific_structure_length_hwtcl 0
set_instance_parameter_value pcie_ep pf5_virtio_isrstatus_bar_indicator_hwtcl 0
set_instance_parameter_value pcie_ep pf5_virtio_isrstatus_bar_offset_hwtcl 0
set_instance_parameter_value pcie_ep pf5_virtio_isrstatus_structure_length_hwtcl 0
set_instance_parameter_value pcie_ep pf5_virtio_notification_bar_indicator_hwtcl 0
set_instance_parameter_value pcie_ep pf5_virtio_notification_bar_offset_hwtcl 0
set_instance_parameter_value pcie_ep pf5_virtio_notification_structure_length_hwtcl 0
set_instance_parameter_value pcie_ep pf5_virtio_pciconfig_access_bar_indicator_hwtcl 0
set_instance_parameter_value pcie_ep pf5_virtio_pciconfig_access_bar_offset_hwtcl 0
set_instance_parameter_value pcie_ep pf5_virtio_pciconfig_access_structure_length_hwtcl 0
set_instance_parameter_value pcie_ep pf6_bar0_prefetchable_hwtcl 1
set_instance_parameter_value pcie_ep pf6_bar0_present_hwtcl 0
set_instance_parameter_value pcie_ep pf6_bar0_size_hwtcl 12
set_instance_parameter_value pcie_ep pf6_bar0_type_hwtcl 1
set_instance_parameter_value pcie_ep pf6_bar1_prefetchable_hwtcl 1
set_instance_parameter_value pcie_ep pf6_bar1_present_hwtcl 0
set_instance_parameter_value pcie_ep pf6_bar1_size_hwtcl 12
set_instance_parameter_value pcie_ep pf6_bar2_prefetchable_hwtcl 1
set_instance_parameter_value pcie_ep pf6_bar2_present_hwtcl 0
set_instance_parameter_value pcie_ep pf6_bar2_size_hwtcl 12
set_instance_parameter_value pcie_ep pf6_bar2_type_hwtcl 1
set_instance_parameter_value pcie_ep pf6_bar3_prefetchable_hwtcl 1
set_instance_parameter_value pcie_ep pf6_bar3_present_hwtcl 0
set_instance_parameter_value pcie_ep pf6_bar3_size_hwtcl 12
set_instance_parameter_value pcie_ep pf6_bar4_prefetchable_hwtcl 1
set_instance_parameter_value pcie_ep pf6_bar4_present_hwtcl 0
set_instance_parameter_value pcie_ep pf6_bar4_size_hwtcl 12
set_instance_parameter_value pcie_ep pf6_bar4_type_hwtcl 1
set_instance_parameter_value pcie_ep pf6_bar5_prefetchable_hwtcl 1
set_instance_parameter_value pcie_ep pf6_bar5_present_hwtcl 0
set_instance_parameter_value pcie_ep pf6_bar5_size_hwtcl 12
set_instance_parameter_value pcie_ep pf6_class_code_hwtcl 0
set_instance_parameter_value pcie_ep pf6_device_id_hwtcl 0
set_instance_parameter_value pcie_ep pf6_exprom_bar_present_hwtcl 0
set_instance_parameter_value pcie_ep pf6_exprom_bar_size_hwtcl 12
set_instance_parameter_value pcie_ep pf6_interrupt_pin_hwtcl inta
set_instance_parameter_value pcie_ep pf6_intr_line_hwtcl 0
set_instance_parameter_value pcie_ep pf6_msi_multi_message_capable_hwtcl 4
set_instance_parameter_value pcie_ep pf6_msix_pba_bir_hwtcl 0
set_instance_parameter_value pcie_ep pf6_msix_pba_offset_hwtcl 0
set_instance_parameter_value pcie_ep pf6_msix_table_bir_hwtcl 0
set_instance_parameter_value pcie_ep pf6_msix_table_offset_hwtcl 0
set_instance_parameter_value pcie_ep pf6_msix_table_size_hwtcl 0
set_instance_parameter_value pcie_ep pf6_pci_prog_intfc_byte_hwtcl 0
set_instance_parameter_value pcie_ep pf6_revision_id_hwtcl 0
set_instance_parameter_value pcie_ep pf6_subclass_code_hwtcl 0
set_instance_parameter_value pcie_ep pf6_subsystem_device_id_hwtcl 0
set_instance_parameter_value pcie_ep pf6_subsystem_vendor_id_hwtcl 0
set_instance_parameter_value pcie_ep pf6_vendor_id_hwtcl 0
set_instance_parameter_value pcie_ep pf6_vf_device_id_hwtcl 0
set_instance_parameter_value pcie_ep pf6_virtio_capability_present_hwtcl 0
set_instance_parameter_value pcie_ep pf6_virtio_cmn_config_bar_indicator_hwtcl 0
set_instance_parameter_value pcie_ep pf6_virtio_cmn_config_bar_offset_hwtcl 0
set_instance_parameter_value pcie_ep pf6_virtio_cmn_config_structure_length_hwtcl 0
set_instance_parameter_value pcie_ep pf6_virtio_device_specific_cap_present_hwtcl 0
set_instance_parameter_value pcie_ep pf6_virtio_devspecific_bar_indicator_hwtcl 0
set_instance_parameter_value pcie_ep pf6_virtio_devspecific_bar_offset_hwtcl 0
set_instance_parameter_value pcie_ep pf6_virtio_devspecific_structure_length_hwtcl 0
set_instance_parameter_value pcie_ep pf6_virtio_isrstatus_bar_indicator_hwtcl 0
set_instance_parameter_value pcie_ep pf6_virtio_isrstatus_bar_offset_hwtcl 0
set_instance_parameter_value pcie_ep pf6_virtio_isrstatus_structure_length_hwtcl 0
set_instance_parameter_value pcie_ep pf6_virtio_notification_bar_indicator_hwtcl 0
set_instance_parameter_value pcie_ep pf6_virtio_notification_bar_offset_hwtcl 0
set_instance_parameter_value pcie_ep pf6_virtio_notification_structure_length_hwtcl 0
set_instance_parameter_value pcie_ep pf6_virtio_pciconfig_access_bar_indicator_hwtcl 0
set_instance_parameter_value pcie_ep pf6_virtio_pciconfig_access_bar_offset_hwtcl 0
set_instance_parameter_value pcie_ep pf6_virtio_pciconfig_access_structure_length_hwtcl 0
set_instance_parameter_value pcie_ep pf7_bar0_prefetchable_hwtcl 1
set_instance_parameter_value pcie_ep pf7_bar0_present_hwtcl 0
set_instance_parameter_value pcie_ep pf7_bar0_size_hwtcl 12
set_instance_parameter_value pcie_ep pf7_bar0_type_hwtcl 1
set_instance_parameter_value pcie_ep pf7_bar1_prefetchable_hwtcl 1
set_instance_parameter_value pcie_ep pf7_bar1_present_hwtcl 0
set_instance_parameter_value pcie_ep pf7_bar1_size_hwtcl 12
set_instance_parameter_value pcie_ep pf7_bar2_prefetchable_hwtcl 1
set_instance_parameter_value pcie_ep pf7_bar2_present_hwtcl 0
set_instance_parameter_value pcie_ep pf7_bar2_size_hwtcl 12
set_instance_parameter_value pcie_ep pf7_bar2_type_hwtcl 1
set_instance_parameter_value pcie_ep pf7_bar3_prefetchable_hwtcl 1
set_instance_parameter_value pcie_ep pf7_bar3_present_hwtcl 0
set_instance_parameter_value pcie_ep pf7_bar3_size_hwtcl 12
set_instance_parameter_value pcie_ep pf7_bar4_prefetchable_hwtcl 1
set_instance_parameter_value pcie_ep pf7_bar4_present_hwtcl 0
set_instance_parameter_value pcie_ep pf7_bar4_size_hwtcl 12
set_instance_parameter_value pcie_ep pf7_bar4_type_hwtcl 1
set_instance_parameter_value pcie_ep pf7_bar5_prefetchable_hwtcl 1
set_instance_parameter_value pcie_ep pf7_bar5_present_hwtcl 0
set_instance_parameter_value pcie_ep pf7_bar5_size_hwtcl 12
set_instance_parameter_value pcie_ep pf7_class_code_hwtcl 0
set_instance_parameter_value pcie_ep pf7_device_id_hwtcl 0
set_instance_parameter_value pcie_ep pf7_exprom_bar_present_hwtcl 0
set_instance_parameter_value pcie_ep pf7_exprom_bar_size_hwtcl 12
set_instance_parameter_value pcie_ep pf7_interrupt_pin_hwtcl inta
set_instance_parameter_value pcie_ep pf7_intr_line_hwtcl 0
set_instance_parameter_value pcie_ep pf7_msi_multi_message_capable_hwtcl 4
set_instance_parameter_value pcie_ep pf7_msix_pba_bir_hwtcl 0
set_instance_parameter_value pcie_ep pf7_msix_pba_offset_hwtcl 0
set_instance_parameter_value pcie_ep pf7_msix_table_bir_hwtcl 0
set_instance_parameter_value pcie_ep pf7_msix_table_offset_hwtcl 0
set_instance_parameter_value pcie_ep pf7_msix_table_size_hwtcl 0
set_instance_parameter_value pcie_ep pf7_pci_prog_intfc_byte_hwtcl 0
set_instance_parameter_value pcie_ep pf7_revision_id_hwtcl 0
set_instance_parameter_value pcie_ep pf7_subclass_code_hwtcl 0
set_instance_parameter_value pcie_ep pf7_subsystem_device_id_hwtcl 0
set_instance_parameter_value pcie_ep pf7_subsystem_vendor_id_hwtcl 0
set_instance_parameter_value pcie_ep pf7_vendor_id_hwtcl 0
set_instance_parameter_value pcie_ep pf7_vf_device_id_hwtcl 0
set_instance_parameter_value pcie_ep pf7_virtio_capability_present_hwtcl 0
set_instance_parameter_value pcie_ep pf7_virtio_cmn_config_bar_indicator_hwtcl 0
set_instance_parameter_value pcie_ep pf7_virtio_cmn_config_bar_offset_hwtcl 0
set_instance_parameter_value pcie_ep pf7_virtio_cmn_config_structure_length_hwtcl 0
set_instance_parameter_value pcie_ep pf7_virtio_device_specific_cap_present_hwtcl 0
set_instance_parameter_value pcie_ep pf7_virtio_devspecific_bar_indicator_hwtcl 0
set_instance_parameter_value pcie_ep pf7_virtio_devspecific_bar_offset_hwtcl 0
set_instance_parameter_value pcie_ep pf7_virtio_devspecific_structure_length_hwtcl 0
set_instance_parameter_value pcie_ep pf7_virtio_isrstatus_bar_indicator_hwtcl 0
set_instance_parameter_value pcie_ep pf7_virtio_isrstatus_bar_offset_hwtcl 0
set_instance_parameter_value pcie_ep pf7_virtio_isrstatus_structure_length_hwtcl 0
set_instance_parameter_value pcie_ep pf7_virtio_notification_bar_indicator_hwtcl 0
set_instance_parameter_value pcie_ep pf7_virtio_notification_bar_offset_hwtcl 0
set_instance_parameter_value pcie_ep pf7_virtio_notification_structure_length_hwtcl 0
set_instance_parameter_value pcie_ep pf7_virtio_pciconfig_access_bar_indicator_hwtcl 0
set_instance_parameter_value pcie_ep pf7_virtio_pciconfig_access_bar_offset_hwtcl 0
set_instance_parameter_value pcie_ep pf7_virtio_pciconfig_access_structure_length_hwtcl 0
set_instance_parameter_value pcie_ep pf_ats_support_hwtcl 0
set_instance_parameter_value pcie_ep pf_enable_function_msix_support_hwtcl 0
set_instance_parameter_value pcie_ep pf_msi_support_hwtcl 0
set_instance_parameter_value pcie_ep pf_tph_support_hwtcl 0
